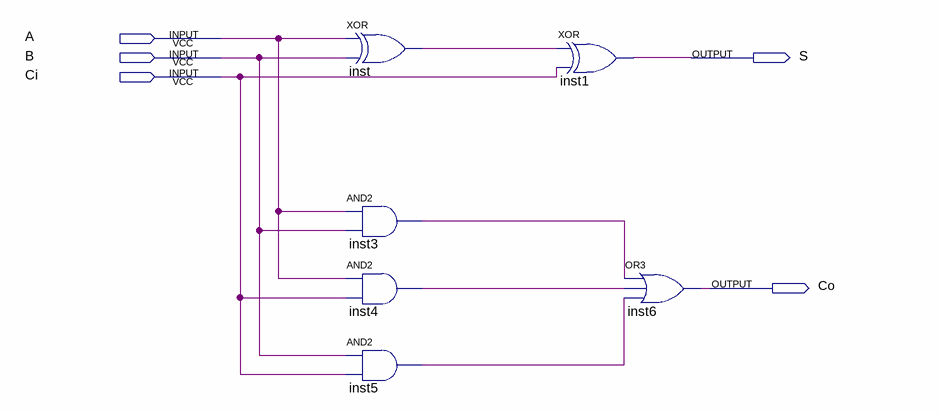
[diagram p0: schematic sheet]
// Quartus schematic SomadorCompleto.bdf as structural Verilog: 6 symbols, 5 pins
module SomadorCompleto (
  input  A,
  input  B,
  input  Ci,
  output S,
  output Co
);

  wire inst3_out, inst4_out, inst5_out, inst_out;

  xor inst (inst_out, A, B);
  and inst3 (inst3_out, A, B);
  and inst4 (inst4_out, A, Ci);
  and inst5 (inst5_out, B, Ci);
  xor inst1 (S, inst_out, Ci);
  or inst6 (Co, inst3_out, inst4_out, inst5_out);
endmodule
